# EasyEDA schematic 1-Schematic_Relay_5v[1].json
TITLE: Sheet_1; REV: 1.0; Date: 2026-06-19; Sheet: 1/1; Drawn By: badigeumeshachari; Company: Your Company
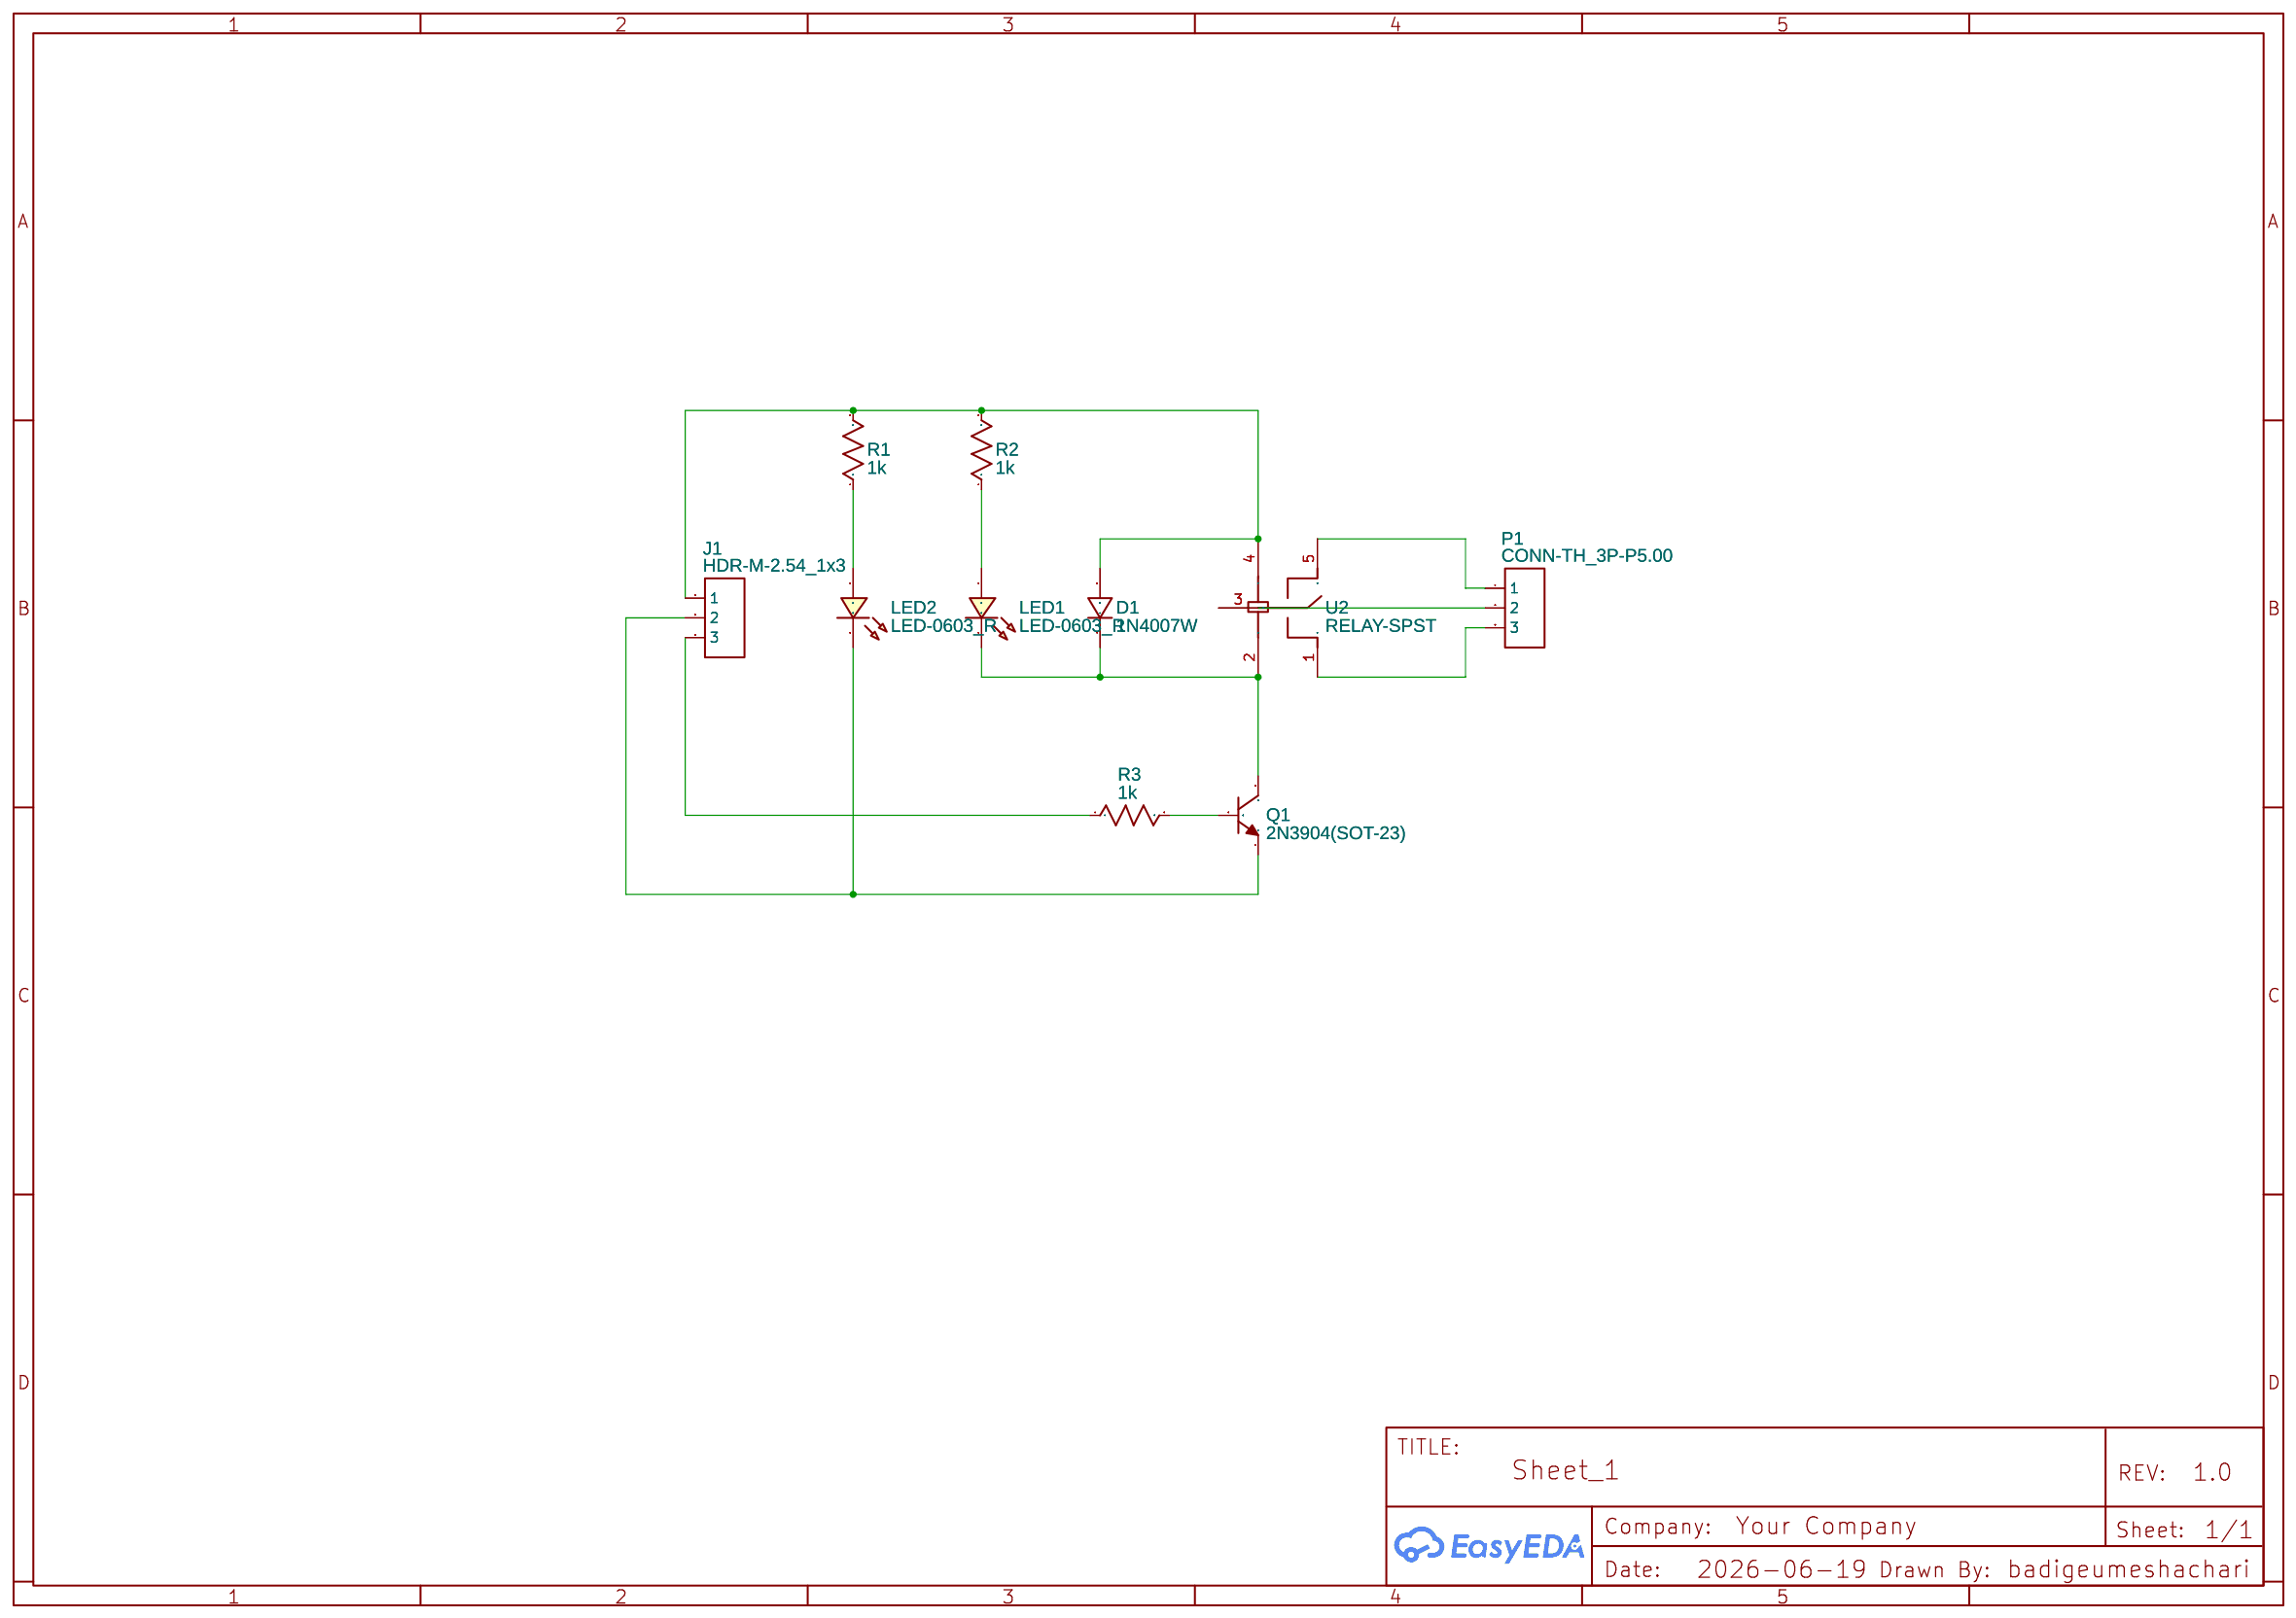
[diagram p0: schematic sheet]

## Parts
D1  1N4007W  [SOD-123_L2.8-W1.8-LS3.7-RD]
J1  HDR-M-2.54_1x3  [HDR-M-2.54_1X3]
LED1  LED-0603_R  [LED0603_RED]
LED2  LED-0603_R  [LED0603_RED]
P1  CONN-TH_3P-P5.00  [CONN-TH_3P-P5.00]
Q1  2N3904(SOT-23)  [SOT-23-3_L2.9-W1.3-P1.90-LS2.4-TR]
R1  1k  [R0603]
R2  1k  [R0603]
R3  1k  [R0603]
U2  RELAY-SPST  [RELAY-TH_RELAY-SPST]

## Library data of the parts
D1 = 1N4007W: Supplier: LCSC; Supplier Part: C328592; Manufacturer: BLUE ROCKET; Contributor: LCEDA_Lib
J1 = HDR-M-2.54_1x3: Supplier Part: C180248; Supplier: LCSC; Contributor: LCEDA_Lib
LED1 LED2 = LED-0603_R: Manufacturer: EVERLIGHT(台湾亿光); Manufacturer Part: 19-217/R6C-AL1M2VY/3T; Supplier Part: C72044; Supplier: LCSC; Contributor: LCEDA_01
P1 = CONN-TH_3P-P5.00: Supplier: LCSC; Contributor: LCEDA_Lib
Q1 = 2N3904(SOT-23): Supplier: LCSC; Manufacturer: KEC; Manufacturer Part: 2n3904S-RTK/PS; Supplier Part: C18536; Paste Type: SOT-23; Contributor: LCEDA_Lib
R1-R3 = R_0603_US: Contributor: LCEDA_Lib
U2 = RELAY-SPST: Contributor: LCSC; Supplier: LCSC; Supplier Part: C2941249; Manufacturer: null; Manufacturer Part: Relay-SPST; JLCPCB Part Class: Extended Part

## Nets
Net-(D1-1): D1.1 LED1.2 Q1.3(C) U2.2
Net-(D1-2): D1.2 J1.1 R1.2 R2.2 U2.4
Net-(J1-2): J1.2 LED2.2 Q1.1(E)
Net-(J1-3): J1.3 R3.1
Net-(LED1-1): LED1.1 R2.1
Net-(LED2-1): LED2.1 R1.1
Net-(P1-1): P1.1 U2.5
Net-(P1-2): P1.2 U2.3
Net-(P1-3): P1.3 U2.1
Net-(Q1-2): Q1.2(B) R3.2
